# EAGLE design DIP-28_C1_IE (EAGLE 6.4)
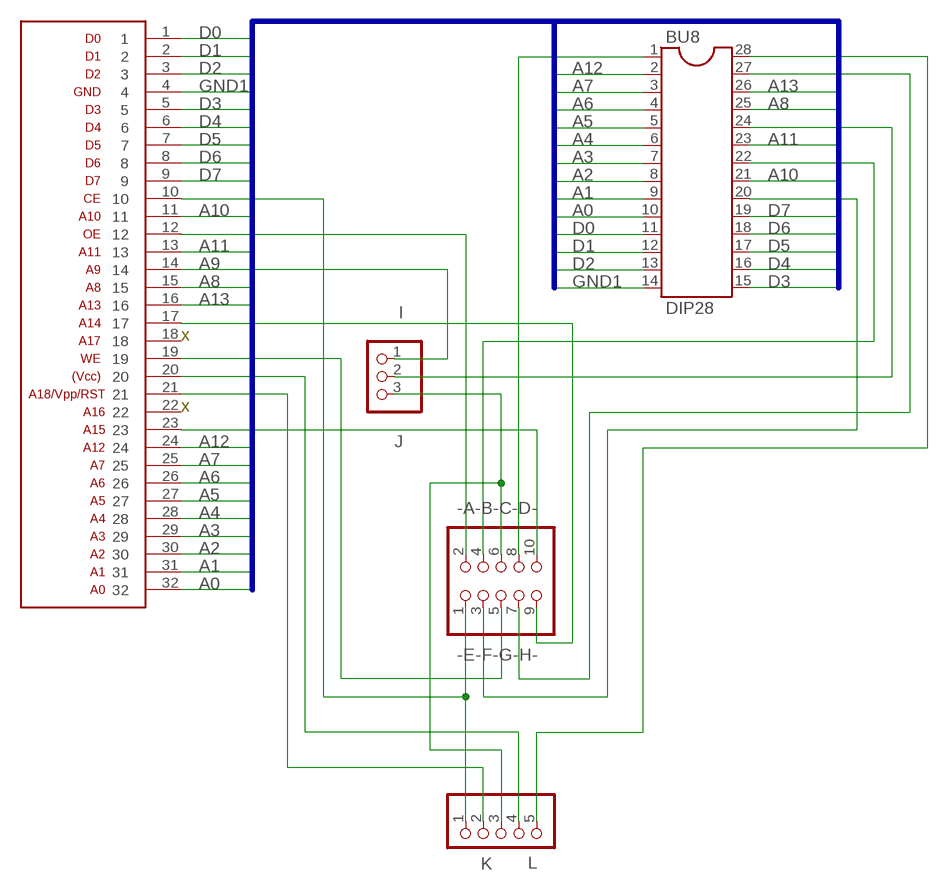
[diagram p0: schematic, sheet 1]

## Parts
-A-B-C-D-  -E-F-G-H-  PINHD-2X5  [2X05]
BU6  EZO-BU3  [EZO-BU3]
BU8  DIP28  [DIP28P]
I  J  PINHD-1X3  [1X03]
K  L  PINHD-1X5  [1X05]

## Nets
A0: BU6.32 BU8.10
A1: BU6.31 BU8.9
A2: BU6.30 BU8.8
A3: BU6.29 BU8.7
A4: BU6.28 BU8.6
A5: BU6.27 BU8.5
A6: BU6.26 BU8.4
A7: BU6.25 BU8.3
A8: BU6.15 BU8.25
A9: BU6.14 I.1
A10: BU6.11 BU8.21
A11: BU6.13 BU8.23
A12: BU6.24 BU8.2
A13: BU6.16 BU8.26
D0: BU6.1 BU8.11
D1: BU6.2 BU8.12
D2: BU6.3 BU8.13
D3: BU6.5 BU8.15
D4: BU6.6 BU8.16
D5: BU6.7 BU8.17
D6: BU6.8 BU8.18
D7: BU6.9 BU8.19
GND1: BU6.4 BU8.14
N$1: BU8.24 I.2
N$2: -A-B-C-D-.3 BU8.20
N$4: -A-B-C-D-.2 BU6.12
N$5: -A-B-C-D-.4 BU8.22
N$6: -A-B-C-D-.6 I.3 K.3
N$7: -A-B-C-D-.8 BU8.1
N$8: -A-B-C-D-.10 BU6.23
N$9: -A-B-C-D-.9 BU6.17
N$10: -A-B-C-D-.7 BU8.27
N$11: -A-B-C-D-.5 BU6.19
N$12: -A-B-C-D-.1 BU6.10 K.1
N$13: BU6.21 K.2
N$14: BU6.20 K.4
N$15: BU8.28 K.5
Unconnected: BU6.18 BU6.22

## Buses
A[0..17],D[0..7],GND1

## Notes on the sheet
- x
- x

## Library data of the parts
-A-B-C-D- = Разъёмы штырьковые 2.54мм:PINHD-2X5: PIN HEADER
BU6 = con-ezo:EZO-BU3
BU8 = con-ezo:DIP28
I = Разъёмы штырьковые 2.54мм:PINHD-1X3: PIN HEADER
K = Разъёмы штырьковые 2.54мм:PINHD-1X5: PIN HEADER

## Board
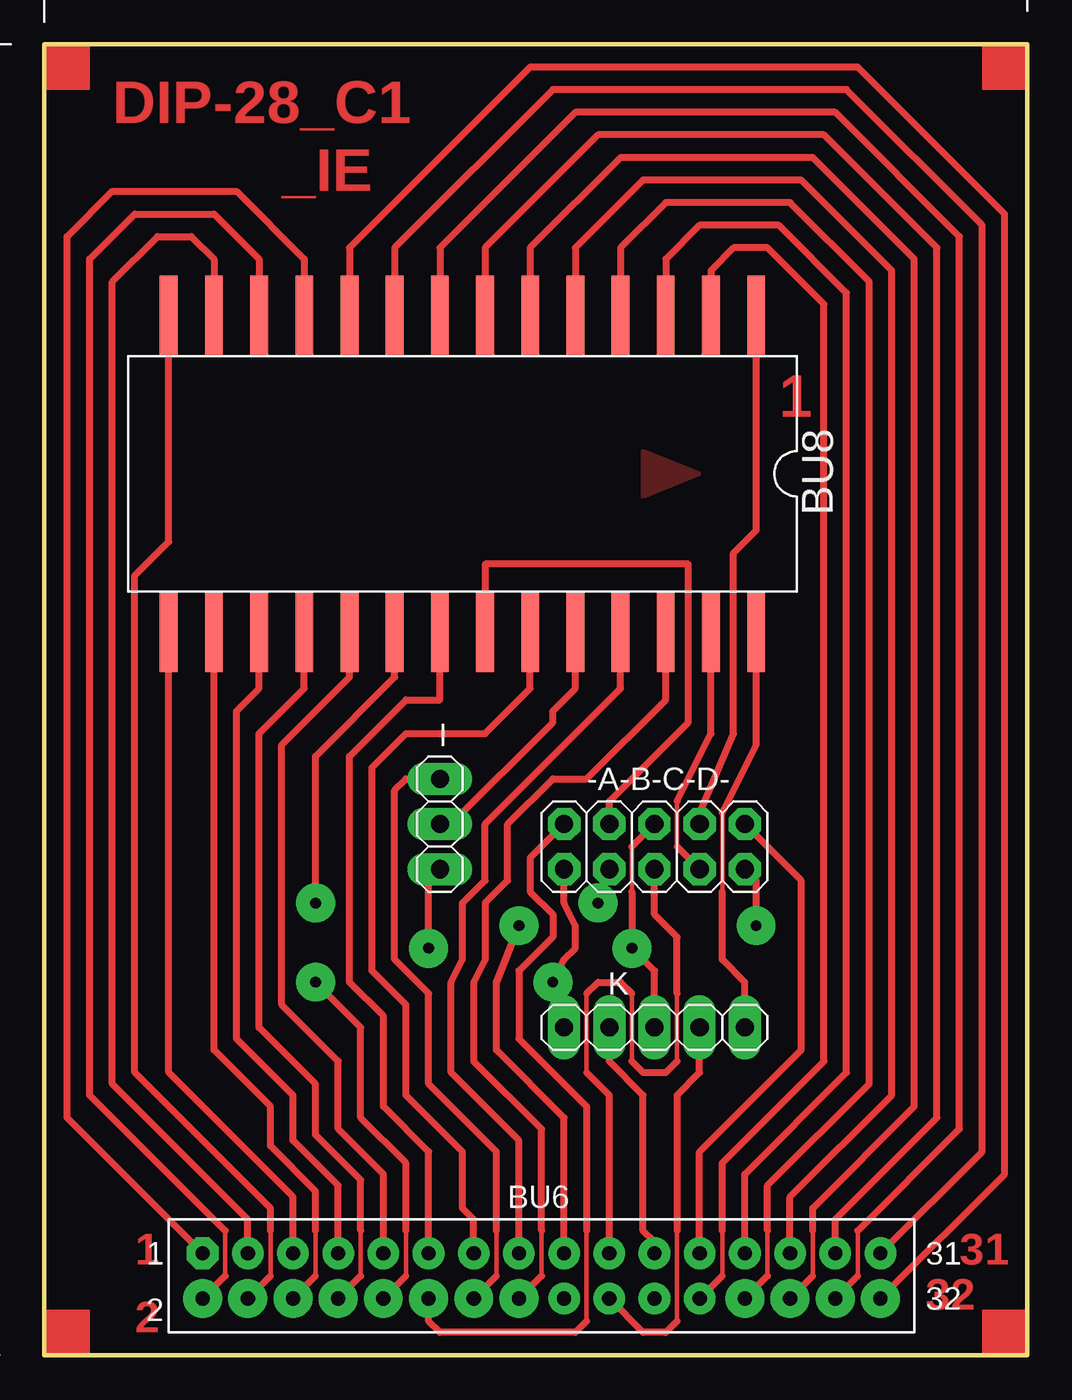
[diagram p1: board, top side]
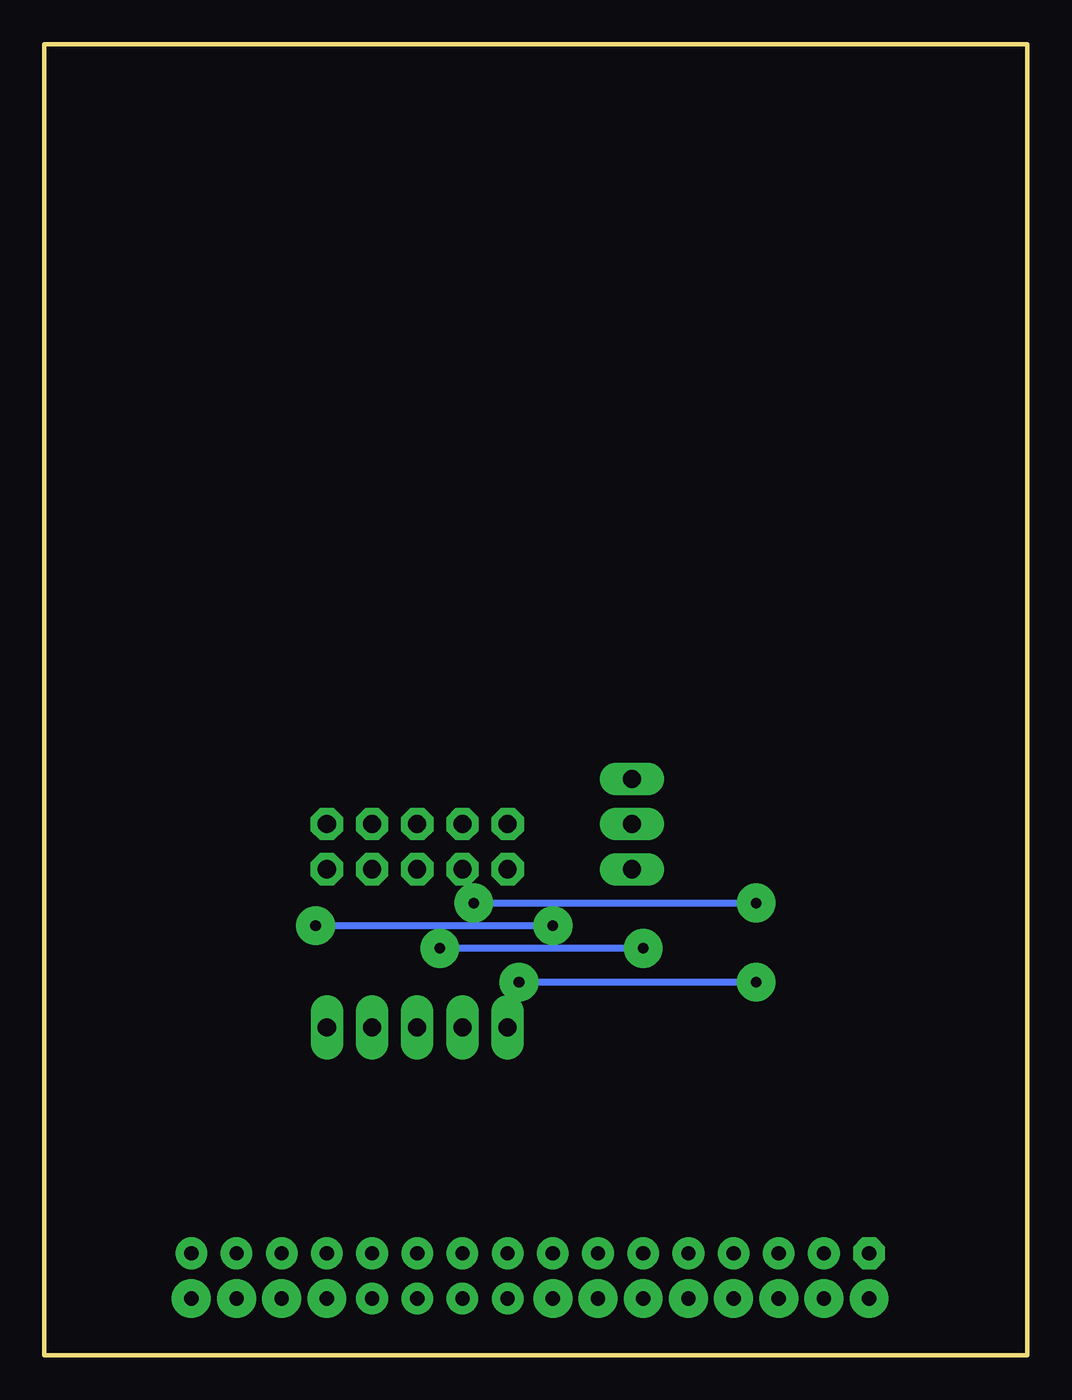
[diagram p2: board, bottom side, seen from below]

Size 55.25 x 73.66 mm. Coordinates in mm from the lower left corner, seen from the top.
Outline: 0,73.66 55.25,73.66 55.25,0 0,0 0,73.66
Copper layers (1*16): Top 0.035mm / dielectric 1.5mm / Bottom 0.035mm
Design rules "default": minimum track width 10mil, minimum drill 24mil, track to track 8mil, track to pad 8mil, pad to pad 8mil, via to via 8mil, smd to smd 8mil, copper to edge 40mil, drill to drill 7mil, minimum pad ring 0.4mm, minimum via ring 8mil, stop-mask expansion 4mil, vias tented up to drill 0mil, thermal gap 10mil

### Footprints (pad centres in the part's own frame; a part is rotated, then mirrored left to right if it is on the bottom)
2X05 = drill 1.016 octagon: 1 -5.08,-1.27; 2 -5.08,1.27; 3 -2.54,-1.27; 4 -2.54,1.27; 5 0,-1.27; 6 0,1.27; 7 2.54,-1.27; 8 2.54,1.27; 9 5.08,-1.27; 10 5.08,1.27
EZO-BU3 = drill 0.8 pad 1.778 octagon: 1 0,0 | drill 0.8 pad 2.184: 2 0,-2.54; 4 2.54,-2.54; 6 5.08,-2.54; 8 7.62,-2.54; 10 10.16,-2.54; 12 12.7,-2.54; 14 15.24,-2.54; 16 17.78,-2.54; 26 30.48,-2.54; 28 33.02,-2.54; 30 35.56,-2.54; 32 38.1,-2.54 | drill 0.8 pad 1.778: 3 2.54,0; 5 5.08,0; 7 7.62,0; 9 10.16,0; 11 12.7,0; 13 15.24,0; 15 17.78,0; 17 20.32,0; 18 20.32,-2.54; 19 22.86,0; 20 22.86,-2.54; 21 25.4,0; 22 25.4,-2.54; 23 27.94,0; 24 27.94,-2.54; 25 30.48,0; 27 33.02,0; 29 35.56,0; 31 38.1,0
DIP28P = smd 1 x 4.5: 1 -16.51,-8.89; 2 -13.97,-8.89; 3 -11.43,-8.89; 4 -8.89,-8.89; 5 -6.35,-8.89; 6 -3.81,-8.89; 7 -1.27,-8.89; 8 1.27,-8.89; 9 3.81,-8.89; 10 6.35,-8.89; 11 8.89,-8.89; 12 11.43,-8.89; 13 13.97,-8.89; 14 16.51,-8.89; 15 16.51,8.89; 16 13.97,8.89; 17 11.43,8.89; 18 8.89,8.89; 19 6.35,8.89; 20 3.81,8.89; 21 1.27,8.89; 22 -1.27,8.89; 23 -3.81,8.89; 24 -6.35,8.89; 25 -8.89,8.89; 26 -11.43,8.89; 27 -13.97,8.89; 28 -16.51,8.89
1X03 = drill 1.016 long: 1 -2.54,0; 2 0,0; 3 2.54,0
1X05 = drill 1.016 long: 1 -5.08,0; 2 -2.54,0; 3 0,0; 4 2.54,0; 5 5.08,0

### Placement (x,y rotation side)
-A-B-C-D-  34.29,28.58 0 top
BU6  8.89,5.71 0 top
BU8  23.49,49.53 180 top
I  22.22,29.84 270 top
K  34.29,18.41 0 top

### Tracks (layer width: path | path; a pad name or v marks a point on that pad's centre or on a via)
A0
  Top 0.406: BU6.32 53.98,10.16 53.98,64.13 45.72,72.39 27.3,72.39 17.14,62.23 BU8.10
A1
  Top 0.406: BU6.31 52.71,11.43 52.71,63.5 45.09,71.12 28.57,71.12 19.68,62.23 BU8.9
A2
  Top 0.254: 45.72,4.45 45.72,6.98
  Top 0.406: BU6.30 45.72,4.45 | 45.72,6.98 51.44,12.7 51.44,62.87 44.45,69.85 29.85,69.85 22.22,62.23 BU8.8
A3
  Top 0.406: BU6.29 44.45,7.62 50.16,13.34 50.16,62.23 43.82,68.58 31.11,68.58 24.76,62.23 BU8.7
A4
  Top 0.254: 43.18,4.45 43.18,6.98
  Top 0.406: BU6.28 43.18,4.45 | BU8.6 27.3,62.23 32.39,67.31 43.18,67.31 48.9,61.6 48.9,13.97 43.18,8.26 43.18,6.98
A5
  Top 0.406: BU6.27 41.91,8.89 47.62,14.61 47.62,60.96 42.55,66.04 33.66,66.04 29.85,62.23 BU8.5
A6
  Top 0.254: 40.64,4.45 40.64,6.98
  Top 0.406: BU6.26 40.64,4.45 | BU8.4 32.39,62.23 34.93,64.77 41.91,64.77 46.36,60.32 46.36,15.24 40.64,9.53 40.64,6.98
A7
  Top 0.406: BU6.25 39.37,10.16 45.09,15.88 45.09,59.69 41.28,63.5 36.83,63.5 34.93,61.6 BU8.3
A8
  Top 0.406: BU6.15 26.67,12.07 22.86,15.88 22.86,20.95 23.49,22.23 23.49,25.4 24.76,26.67 24.76,29.84 32.39,37.47 BU8.25
A9
  Top 0.254: 25.4,4.45 25.4,6.98
  Top 0.406: BU6.14 25.4,4.45 | I.1 20.32,32.38 19.68,31.75 19.68,22.23 21.59,20.32 21.59,15.24 25.4,11.43 25.4,6.98
A10
  Top 0.406: BU6.11 21.59,11.43 19.05,13.97 19.05,19.05 17.14,20.95 17.14,33.66 20.32,36.83 22.22,36.83 BU8.21
A11
  Top 0.406: BU6.13 24.13,7.62 23.49,8.26 23.49,11.43 20.32,14.61 20.32,19.69 18.41,21.59 18.41,33.02 20.32,34.93 24.76,34.93 27.3,37.47 BU8.23
A12
  Top 0.254: 38.1,4.45 38.1,6.98
  Top 0.406: BU6.24 38.1,4.45 | BU8.2 37.47,60.96 38.73,62.23 40.64,62.23 43.82,59.05 43.82,16.51 38.1,10.8 38.1,6.98
A13
  Top 0.254: 27.94,4.45 27.94,6.98
  Top 0.406: BU6.16 27.94,4.45 | BU8.26 34.93,36.83 30.48,32.38 28.57,32.38 26.04,29.84 26.04,26.67 24.76,25.4 24.76,22.23 24.13,20.95 24.13,16.51 27.94,12.7 27.94,6.98
D0
  Top 0.406: BU6.1 1.27,13.34 1.27,62.87 3.81,65.41 10.79,65.41 14.61,61.6 BU8.11
D1
  Top 0.254: 10.16,4.45 10.16,6.98
  Top 0.406: BU6.2 10.16,4.45 | 10.16,6.98 2.54,14.61 2.54,61.6 5.08,64.13 9.52,64.13 12.06,61.6 BU8.12
D2
  Top 0.406: BU6.3 11.43,7.62 3.81,15.24 3.81,60.32 6.35,62.87 8.25,62.87 9.52,61.6 BU8.13
D3
  Top 0.406: BU6.5 13.97,8.89 6.99,15.88 BU8.15
D4
  Top 0.254: 15.24,4.45 15.24,6.98
  Top 0.406: BU6.6 15.24,4.45 | 15.24,6.98 15.24,9.21 12.7,11.75 12.7,13.97 9.52,17.15 BU8.16
D5
  Top 0.406: BU6.7 16.51,9.53 13.97,12.07 13.97,14.61 10.79,17.78 10.79,36.2 12.06,37.47 BU8.17
D6
  Top 0.254: 17.78,4.45 17.78,6.98
  Top 0.406: 14.61,41.91 BU8.18 14.61,37.47 12.06,34.93 12.06,18.41 15.24,15.24 15.24,12.38 17.78,9.84 17.78,6.98 | BU6.8 17.78,4.45
D7
  Top 0.406: BU6.9 19.05,10.16 16.51,12.7 16.51,16.51 13.33,19.69 13.33,34.29 17.14,38.1 BU8.19
GND1
  Top 0.254: 12.7,4.45 12.7,6.98
  Top 0.406: BU6.4 12.7,4.45 | 12.7,6.98 12.7,8.26 5.08,15.88 5.08,43.81 6.99,45.72 BU8.14
N$1
  Top 0.406: I.2 22.86,29.84 28.57,35.56 28.57,36.2 29.85,37.47 BU8.24
N$2  (via drill 0.6 pad 2.18)
  Top 0.406: -A-B-C-D-.3 v31.11,25.4 | BU8.20 19.68,38.1 15.24,33.66 v15.24,25.4
  Bottom 0.406: v31.11,25.4 v15.24,25.4
N$3
  pour Top: 36.83,49.53 33.66,50.8 33.66,48.26
N$4
  Top 0.254: 30.48,6.98 30.48,1.91
  Top 0.406: -A-B-C-D-.2 27.3,27.94 27.3,26.04 28.57,24.77 28.57,23.49 26.67,21.59 26.67,17.78 30.48,13.97 30.48,6.98 | 30.48,1.91 29.85,1.27 22.22,1.27 21.59,1.91 BU6.12
N$5
  Top 0.406: BU8.22 24.76,44.45 36.2,44.45 36.2,35.56 31.75,31.12 -A-B-C-D-.4
N$6  (via drill 0.6 pad 2.18)
  Top 0.254: 33.02,28.58 33.02,26.04
  Top 0.406: 33.02,28.58 -A-B-C-D-.6 | K.3 34.29,21.59 v33.02,22.86 33.02,26.04 | v21.59,22.86 21.59,26.67 I.3
  Bottom 0.406: v21.59,22.86 v33.02,22.86
N$7
  Top 0.406: -A-B-C-D-.8 36.83,30.48 38.73,34.93 38.73,45.09 40.01,46.35 BU8.1
N$8
  Top 0.406: BU6.23 36.83,11.43 42.55,17.15 42.55,26.67 -A-B-C-D-.10
N$9  (via drill 0.6 pad 2.18)
  Top 0.406: BU6.17 29.21,13.34 25.4,17.15 25.4,20.95 v26.67,24.13 | v40.01,24.13 40.01,26.67 -A-B-C-D-.9
  Bottom 0.406: v26.67,24.13 v40.01,24.13
N$10
  Top 0.254: 35.56,28.58 35.56,31.12
  Top 0.406: -A-B-C-D-.7 35.56,28.58 | 35.56,31.12 37.47,34.93 BU8.27
N$11
  Top 0.254: 30.48,15.88 30.48,20.32 | 33.02,20.32 33.02,16.51 | 35.56,16.51 35.56,20.32
  Top 0.406: BU6.19 31.75,14.61 30.48,15.88 | 30.48,20.32 31.11,20.95 32.39,20.95 33.02,20.32 | 33.02,16.51 33.66,15.88 34.93,15.88 35.56,16.51 | -A-B-C-D-.5 34.29,24.77 35.56,23.49 35.56,20.32
N$12  (via drill 0.6 pad 2.18)
  Top 0.254: 20.32,4.45 20.32,6.98
  Top 0.406: K.1 v28.57,20.95 29.21,22.23 29.85,22.86 29.85,24.13 29.21,25.4 -A-B-C-D-.1 | BU6.10 20.32,4.45 | 20.32,6.98 20.32,10.8 17.78,13.34 17.78,18.41 v15.24,20.95
  Bottom 0.406: v15.24,20.95 v28.57,20.95
N$13
  Top 0.406: K.2 31.75,16.51 33.66,14.61 33.66,6.98 34.29,6.35 BU6.21
N$14
  Top 0.254: 35.56,6.98 35.56,1.91
  Top 0.406: BU6.20 33.66,1.27 34.93,1.27 35.56,1.91 | K.4 36.83,15.88 35.56,14.61 35.56,6.98
N$15
  Top 0.254: 38.1,26.04 38.1,30.48
  Top 0.406: K.5 39.37,20.95 38.1,22.23 38.1,26.04 | 38.1,30.48 40.01,34.29 BU8.28
(copper drawn outside any net)
  shapes: Top area x4

### Text on the board
Top: DIP-28_C1 | _IE | 1 | 1 | 31 | 32 | 2